# EAGLE design br1 (EAGLE 5.07)
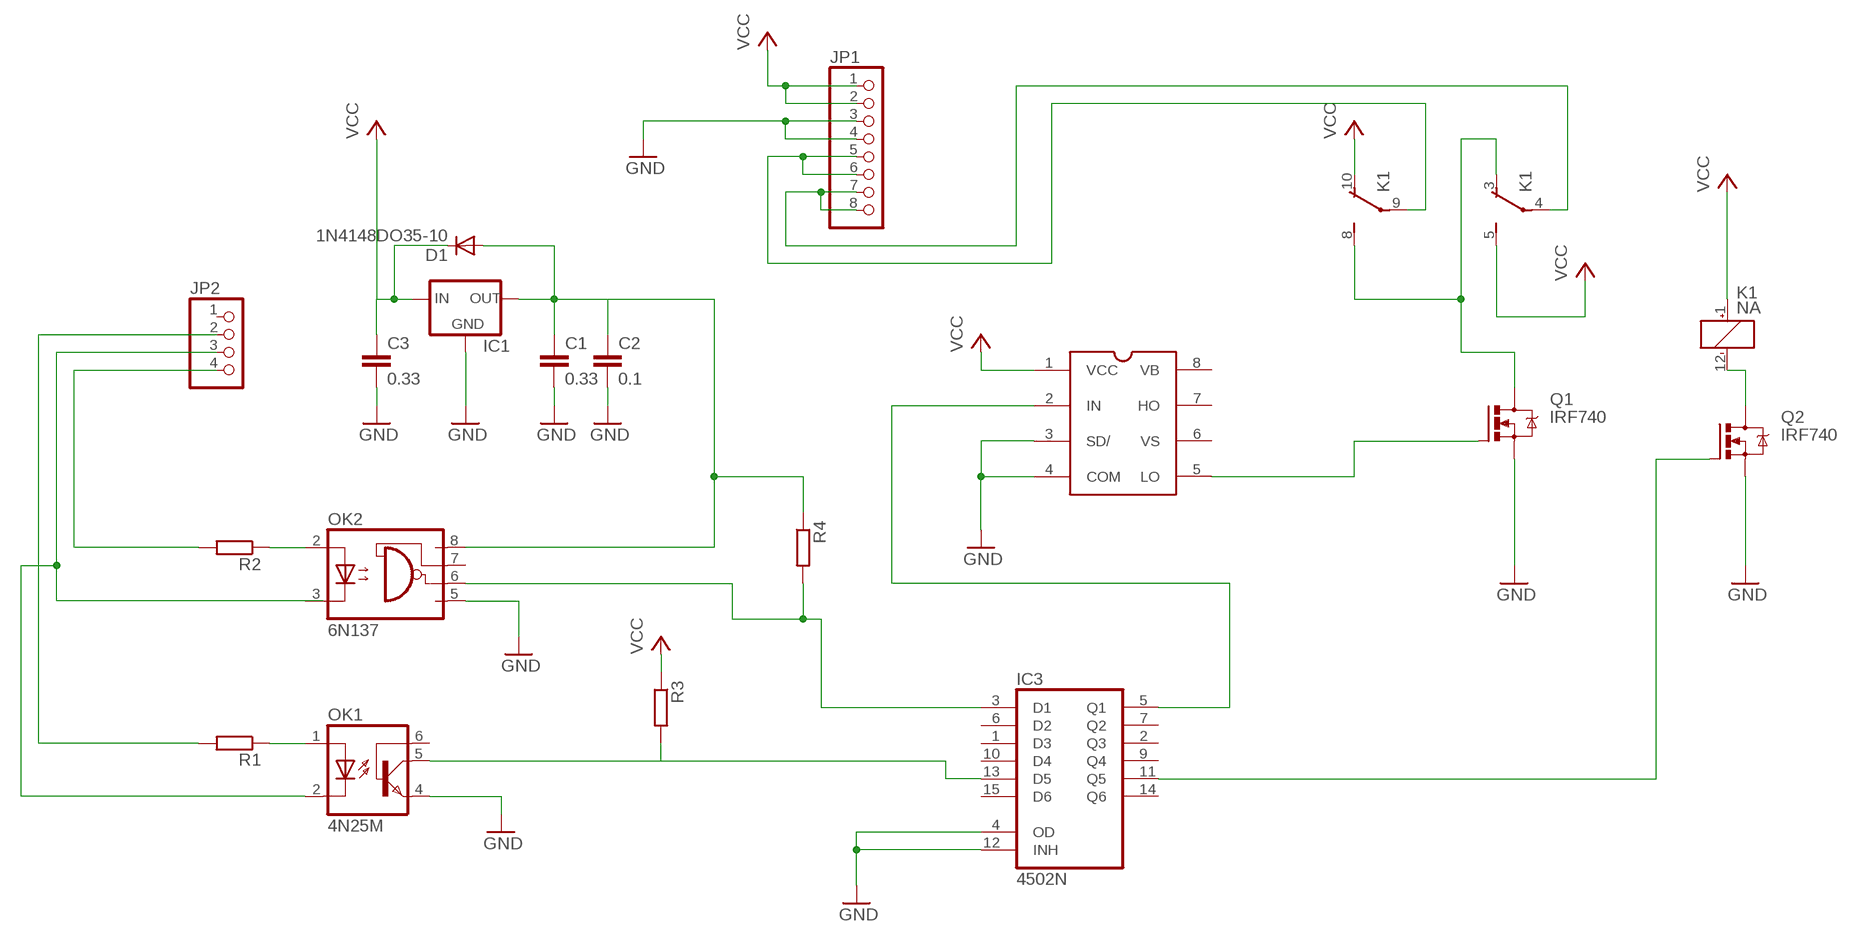
[diagram p0: schematic, sheet 1]

## Parts
C1  0.33  C-EU025-050X050  [C025-050X050]
C2  0.1  C-EU025-050X050  [C025-050X050]
C3  0.33  C-EU025-050X050  [C025-050X050]
D1  1N4148DO35-10  [DO35-10]
IC1  78XXS  [78XXS]
IC3  4502N  [DIL16]
JP1  PINHD-1X8  [1X08]
JP2  PINHD-1X4  [1X04]
K1  NA  [NA]
OK1  4N25M  [DIL06]
OK2  6N137  [DIL08]
Q1  IRF740  [TO220BV]
Q2  IRF740  [TO220BV]
R1  R-EU_0207/10  [0207/10]
R2  R-EU_0207/10  [0207/10]
R3  R-EU_0207/10  [0207/10]
R4  R-EU_0207/10  [0207/10]
U$1  IR2104  [IR2104]

## Nets
N$1: C1.1 C2.1 D1.A IC1.OUT OK2.8(VCC) R4.1
N$2: Q1.G U$1.5(LO)
N$3: K1.12(1:-) Q2.D
N$4: JP1.5 JP1.6 K1.9(3:P)
N$6: OK2.2(A) R2.1
N$7: K1.3(2:O) K1.8(3:S) Q1.D
N$8: OK1.1(A) R1.1
N$9: JP2.3 OK1.2(C)
N$10: JP2.2 R1.2
N$11: C1.2 C2.2 C3.2 IC1.GND IC3.4(OD) IC3.12(INH) JP1.3 JP1.4 OK1.4(EMI) OK2.5(GND) Q1.S Q2.S U$1.3(SD/) U$1.4(COM) ; supply symbol labelled GND
N$12: JP2.4 R2.2
N$13: IC3.13(D5) OK1.5(COL) R3.2
N$15: IC3.3(D1) OK2.6(VO) R4.2
N$17: IC3.5(Q1) U$1.2(IN)
N$18: JP1.7 JP1.8 K1.4(2:P)
N$19: IC3.11(Q5) Q2.G
VCC: C3.1 D1.C IC1.IN JP1.1 JP1.2 K1.1(1:+) K1.5(2:S) K1.10(3:O) R3.1 U$1.1(VCC)
Unconnected: IC3.1(D3) IC3.2(Q3) IC3.6(D2) IC3.7(Q2) IC3.9(Q4) IC3.10(D4) IC3.14(Q6) IC3.15(D6) JP2.1 OK1.6(BAS) OK2.3(C) OK2.7(VE) U$1.7(HO)

## Power pins joined to a net without a drawn wire
VB: U$1.8(VB)
VDD: IC3.16(VDD)
VS: U$1.6(VS)
VSS: IC3.8(VSS)

## Library data of the parts
C1-C3 = rcl:C-EU: CAPACITOR, European symbol
D1 = diode:1N4148: DIODE high speed (Philips)
IC1 = v-reg:78XXS: VOLTAGE REGULATOR
IC3 = 45xx:4502: Stored hex INVERTER/BUFFER
JP1 = pinhead:PINHD-1X8: PIN HEADER
JP2 = pinhead:PINHD-1X4: PIN HEADER
K1 = dbg-misc:NA: RELAY
OK1 = optocoupler:4N*?M: General Purpose 6-Pin Phototransistor Optocouplers Source: http://www.fairchildsemi.com/ds/4N/4N35-M.pdf
OK2 = optocoupler:6N137: MOTOROLA OPTO COUPLER
Q1 Q2 = transistor-power:IRF740: N-CHANNEL MOS FET
R1-R4 = rcl:R-EU_: RESISTOR, European symbol
U$1 = ir-2104:IR2104: Half Bridge mosfet - IGBT driver

## Board
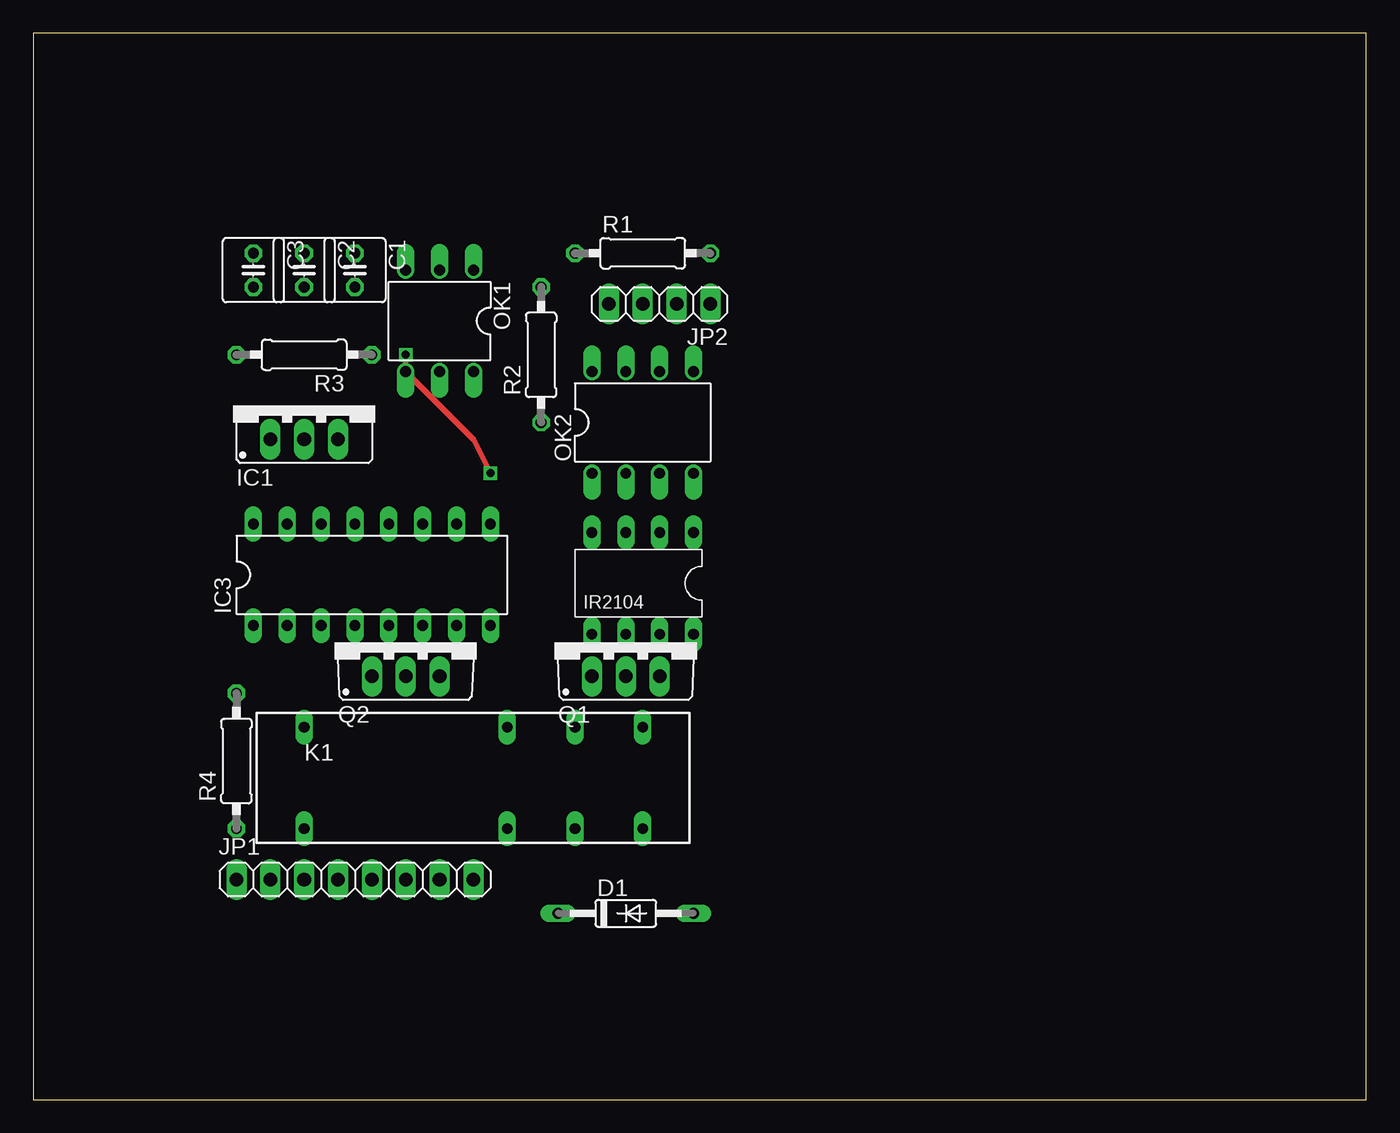
[diagram p1: board, top side]
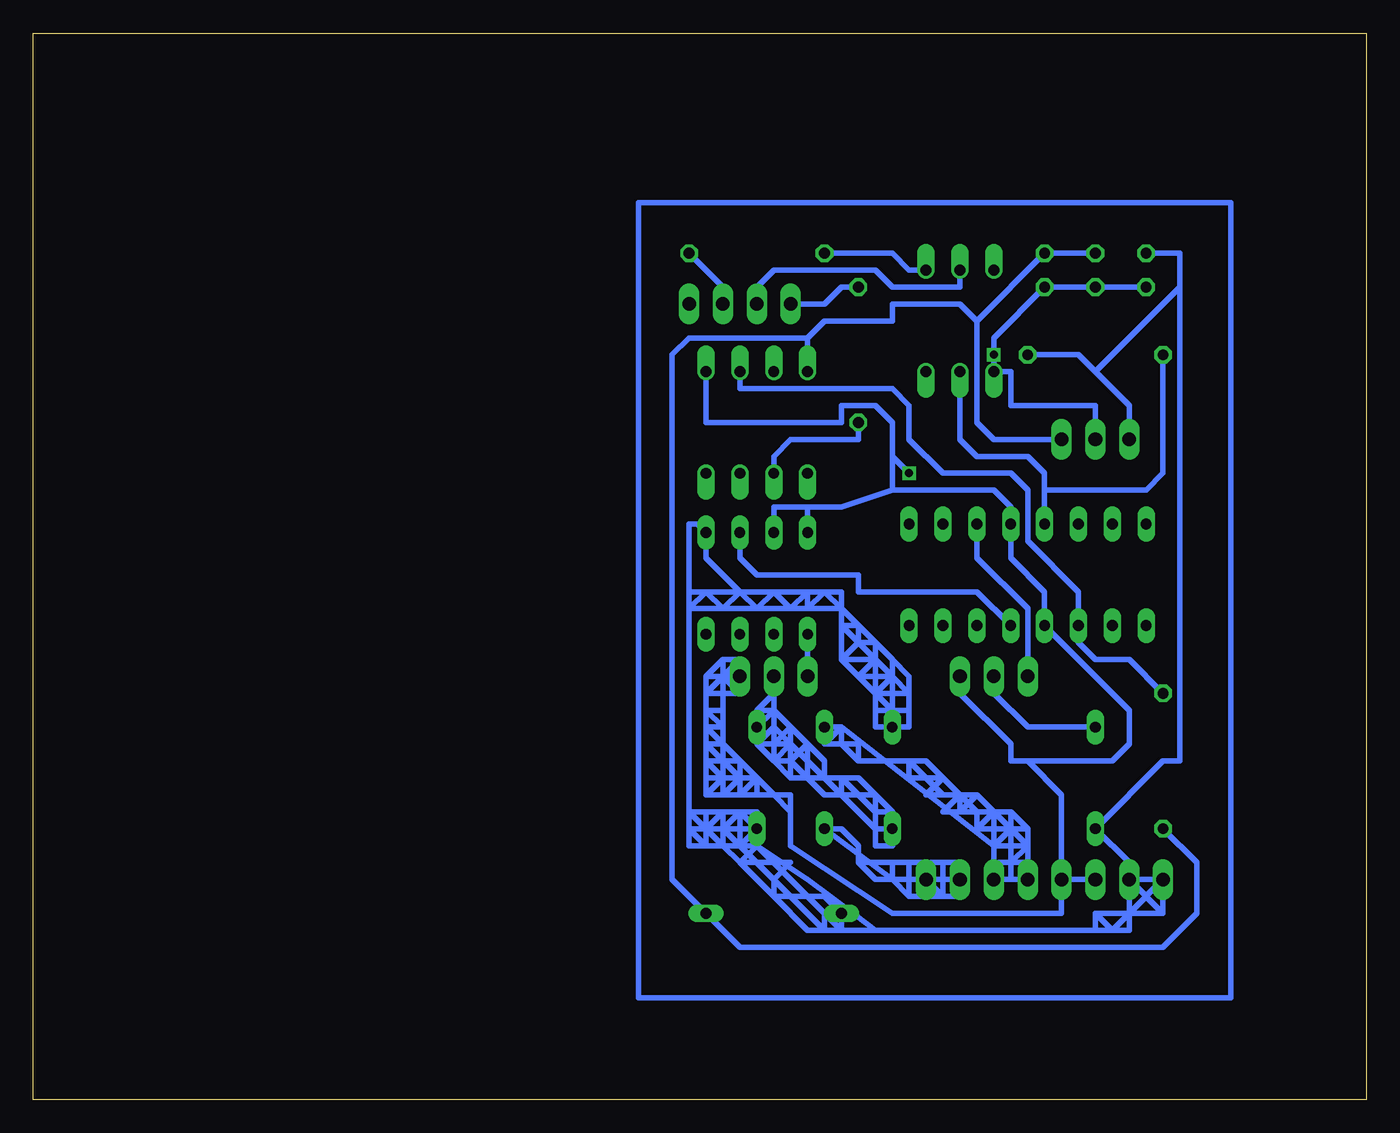
[diagram p2: board, bottom side, seen from below]

Size 100 x 80 mm. Coordinates in mm from the lower left corner, seen from the top.
Outline: 0,0 100,0 100,80 0,80 0,0
Copper layers (1*16): Top 0.0356mm / dielectric 1.5011mm / Bottom 0.0356mm
Design rules "default": minimum track width 7mil, minimum drill 14mil, track to track 7mil, track to pad 7mil, pad to pad 7mil, via to via 7mil, smd to smd 0mil, copper to edge 20mil, drill to drill 8mil, minimum pad ring 10mil, minimum via ring 8mil, stop-mask expansion 4mil, vias tented up to drill 0mil, thermal gap 10mil

### Footprints (pad centres in the part's own frame; a part is rotated, then mirrored left to right if it is on the bottom)
C025-050X050 = drill 0.813 octagon: 1 -1.27,0; 2 1.27,0
DO35-10 = drill 0.813 long: A 5.08,0; C -5.08,0
78XXS = drill 1.016 long: GND 0,-2.54; IN -2.54,-2.54; OUT 2.54,-2.54
DIL16 = drill 0.813 long: 1 -8.89,-3.81; 2 -6.35,-3.81; 3 -3.81,-3.81; 4 -1.27,-3.81; 5 1.27,-3.81; 6 3.81,-3.81; 7 6.35,-3.81; 8 8.89,-3.81; 9 8.89,3.81; 10 6.35,3.81; 11 3.81,3.81; 12 1.27,3.81; 13 -1.27,3.81; 14 -3.81,3.81; 15 -6.35,3.81; 16 -8.89,3.81
1X08 = drill 1.016 long: 1 -8.89,0; 2 -6.35,0; 3 -3.81,0; 4 -1.27,0; 5 1.27,0; 6 3.81,0; 7 6.35,0; 8 8.89,0
1X04 = drill 1.016 long: 1 -3.81,0; 2 -1.27,0; 3 1.27,0; 4 3.81,0
NA = drill 0.8 long: 1 -6.35,-5.08; 3 8.89,-5.08; 4 13.97,-5.08; 5 19.05,-5.08; 8 19.05,2.54; 9 13.97,2.54; 10 8.89,2.54; 12 -6.35,2.54
DIL06 = drill 0.813 offset: 1 -2.54,-3.81; 2 0,-3.81; 3 2.54,-3.81; 4 2.54,3.81; 5 0,3.81; 6 -2.54,3.81
DIL08 = drill 0.813 offset: 1 -3.81,-3.81; 2 -1.27,-3.81; 3 1.27,-3.81; 4 3.81,-3.81; 5 3.81,3.81; 6 1.27,3.81; 7 -1.27,3.81; 8 -3.81,3.81
TO220BV = drill 1.016 long: D 0,-2.54; G -2.54,-2.54; S 2.54,-2.54
0207/10 = drill 0.813 octagon: 1 -5.08,0; 2 5.08,0
IR2104 = drill 0.8 long: 1 -1.905,8.89; 2 -1.905,6.35; 3 -1.905,3.81; 4 -1.905,1.27; 5 5.715,1.27; 6 5.715,3.81; 7 5.715,6.35; 8 5.715,8.89

### Placement (x,y rotation side)
C1  24.13,62.23 270 top
C2  20.32,62.23 270 top
C3  16.51,62.23 270 top
D1  44.45,13.97 0 top
IC1  20.32,52.07 0 top
IC3  25.4,39.37 0 top
JP1  24.13,16.51 0 top
JP2  46.99,59.69 180 top
K1  26.67,25.4 0 top
OK1  30.48,58.42 180 top
OK2  45.72,50.8 0 top
Q1  44.45,34.29 0 top
Q2  27.94,34.29 0 top
R1  45.72,63.5 0 top
R2  38.1,55.88 90 top
R3  20.32,55.88 180 top
R4  15.24,25.4 90 top
U$1  40.64,40.64 270 top

### Tracks (layer width: path | path; a pad name or v marks a point on that pad's centre or on a via)
N$1
  Bottom 0.406: 41.91,57.15 50.8,57.15 52.07,55.88 52.07,16.51 D1.A 46.99,11.43 15.24,11.43 12.7,13.97 12.7,17.78 R4.1 | 41.91,57.15 OK2.8 | 41.91,57.15 40.64,58.42 35.56,58.42 35.56,59.69 30.48,59.69 29.21,58.42 | IC1.OUT 27.94,49.53 29.21,50.8 29.21,58.42 | 29.21,58.42 C1.1 C2.1
N$2
  Bottom 0.406: Q1.G U$1.5
N$3
  Bottom 0.406: Q2.D 27.94,30.48 25.4,27.94 K1.12
N$4
  Bottom 0.406: 39.37,27.94 K1.9 | 27.94,17.78 JP1.6 26.67,16.51 | 27.94,17.78 27.94,19.05 | 27.94,19.05 39.37,27.94 | 26.67,16.51 JP1.5 25.4,17.78 | 25.4,17.78 25.4,19.05 | 25.4,19.05 25.4,20.32 | 25.4,20.32 26.67,21.59 | 26.67,21.59 27.94,21.59 | 27.94,21.59 29.21,22.86 | 29.21,22.86 30.48,22.86 | 30.48,22.86 31.75,24.13 | 31.75,24.13 33.02,25.4 34.29,25.4 | 34.29,25.4 31.75,22.86 | 29.21,21.59 27.94,21.59 | 27.94,21.59 26.67,20.32 | 26.67,20.32 25.4,19.05 | 25.4,17.78 26.67,17.78 | 27.94,17.78 26.67,17.78 | 26.67,17.78 25.4,19.05 | 25.4,19.05 26.67,19.05 | 26.67,19.05 27.94,19.05 | 27.94,19.05 26.67,20.32 | 26.67,20.32 27.94,20.32 | 27.94,20.32 29.21,20.32 | 29.21,21.59 30.48,21.59 | 30.48,21.59 30.48,22.86 | 30.48,22.86 31.75,22.86 | 31.75,22.86 33.02,22.86 31.75,24.13 | 31.75,24.13 34.29,24.13 34.29,25.4 | 34.29,25.4 38.1,25.4 | 38.1,25.4 39.37,26.67 | 39.37,26.67 40.64,26.67 39.37,27.94 | 39.37,27.94 39.37,26.67 | 39.37,26.67 38.1,26.67 38.1,25.4 | 26.67,19.05 26.67,17.78 | 26.67,19.05 26.67,20.32 | 26.67,21.59 26.67,20.32 | 26.67,20.32 25.4,20.32 | 27.94,20.32 27.94,19.05 | 27.94,20.32 27.94,21.59 | 27.94,21.59 29.21,20.32 | 29.21,20.32 29.21,21.59 | 29.21,21.59 30.48,22.86 | 30.48,22.86 31.75,21.59 30.48,21.59 | 30.48,21.59 29.21,22.86 | 26.67,17.78 26.67,16.51
N$6
  Bottom 0.406: OK2.2 44.45,48.26 43.18,49.53 38.1,49.53 R2.1
N$7
  Bottom 0.406: 44.45,29.21 44.45,30.48 | 44.45,30.48 Q1.D | 45.72,26.67 K1.8 | 43.18,24.13 44.45,25.4 | 44.45,25.4 45.72,26.67 | 39.37,24.13 38.1,24.13 36.83,22.86 | 39.37,24.13 40.64,24.13 | 41.91,24.13 43.18,24.13 | 35.56,21.59 36.83,22.86 | K1.3 35.56,19.05 36.83,19.05 36.83,20.32 | 36.83,20.32 36.83,21.59 | 36.83,21.59 38.1,22.86 | 38.1,22.86 39.37,22.86 | 39.37,22.86 40.64,22.86 41.91,24.13 | 41.91,24.13 40.64,24.13 | 40.64,24.13 40.64,25.4 41.91,26.67 | 41.91,26.67 43.18,27.94 | 43.18,27.94 44.45,29.21 | 44.45,29.21 44.45,27.94 | 44.45,25.4 44.45,26.67 | 44.45,26.67 43.18,27.94 | 43.18,27.94 43.18,26.67 | 43.18,26.67 43.18,25.4 | 43.18,24.13 43.18,25.4 | 43.18,25.4 41.91,26.67 | 41.91,26.67 41.91,24.13 | 41.91,24.13 43.18,25.4 | 44.45,26.67 44.45,27.94 | 44.45,27.94 43.18,26.67 | 43.18,26.67 39.37,22.86 | 39.37,22.86 39.37,24.13 | 39.37,24.13 38.1,22.86 | 38.1,22.86 36.83,22.86 | 36.83,22.86 36.83,21.59 | 36.83,21.59 35.56,21.59 | 35.56,21.59 K1.3 | K1.3 36.83,20.32 | 36.83,20.32 39.37,22.86 | 43.18,25.4 44.45,25.4 | 44.45,25.4 43.18,26.67 | 43.18,26.67 44.45,26.67 | 45.72,26.67 44.45,27.94 | 45.72,26.67 44.45,26.67 | 44.45,30.48 45.72,29.21 | 45.72,29.21 K1.8 | K1.8 44.45,29.21 | 44.45,29.21 45.72,29.21
N$8
  Bottom 0.406: R1.1 35.56,63.5 34.29,62.23 OK1.1
N$9
  Bottom 0.406: JP2.3 45.72,60.96 44.45,62.23 36.83,62.23 35.56,60.96 30.48,60.96 OK1.2
N$10
  Bottom 0.406: JP2.2 48.26,60.96 R1.2
N$11  (via drill 0.6)
  Top 0.406: v34.29,46.99 33.02,49.53 OK1.4 v27.94,55.88
  Bottom 0.406: 46.99,33.02 48.26,33.02 | IC1.GND 20.32,52.07 26.67,52.07 26.67,54.61 OK1.4 v27.94,55.88 27.94,57.15 C1.2 C2.2 C3.2 | 48.26,29.21 48.26,30.48 | 48.26,31.75 Q1.S | 44.45,22.86 45.72,22.86 | 46.99,22.86 48.26,22.86 | 43.18,21.59 43.18,19.05 35.56,13.97 22.86,13.97 JP1.4 | 35.56,45.72 39.37,44.45 41.91,44.45 | 25.4,25.4 26.67,25.4 26.67,26.67 30.48,30.48 Q2.S | JP1.3 JP1.4 | JP1.4 22.86,22.86 25.4,25.4 | 25.4,25.4 19.05,25.4 17.78,26.67 17.78,29.21 IC3.4 24.13,38.1 26.67,40.64 IC3.12 26.67,44.45 27.94,45.72 35.56,45.72 | OK2.5 49.53,50.8 39.37,50.8 39.37,52.07 36.83,52.07 35.56,50.8 35.56,48.26 | 35.56,45.72 35.56,48.26 | 35.56,48.26 v34.29,46.99 | 41.91,44.45 U$1.4 | 41.91,44.45 44.45,44.45 U$1.3 | 48.26,31.75 48.26,30.48 | 48.26,30.48 46.99,30.48 | 48.26,30.48 49.53,30.48 | 49.53,30.48 49.53,31.75 | 48.26,31.75 49.53,30.48 | 49.53,30.48 49.53,29.21 | 49.53,29.21 49.53,27.94 | 49.53,27.94 49.53,26.67 | 49.53,26.67 49.53,25.4 | 49.53,25.4 49.53,24.13 | 49.53,24.13 49.53,22.86 | 48.26,22.86 48.26,24.13 | 48.26,24.13 48.26,25.4 | 48.26,26.67 48.26,27.94 | 48.26,27.94 49.53,29.21 | 49.53,29.21 48.26,29.21 | 48.26,29.21 48.26,27.94 | 48.26,27.94 49.53,27.94 | 49.53,27.94 48.26,26.67 | 48.26,26.67 49.53,26.67 | 49.53,26.67 48.26,25.4 | 48.26,25.4 49.53,25.4 | 49.53,25.4 48.26,24.13 | 49.53,24.13 48.26,24.13 | 48.26,24.13 49.53,22.86 | 49.53,22.86 48.26,22.86 | 48.26,22.86 46.99,24.13 | 46.99,24.13 48.26,24.13 | 46.99,24.13 45.72,24.13 | 45.72,24.13 45.72,22.86 | 45.72,22.86 46.99,22.86 | 46.99,22.86 45.72,24.13 | 45.72,24.13 44.45,22.86 | 44.45,22.86 43.18,21.59 | 43.18,21.59 43.18,22.86 44.45,22.86 | 45.72,24.13 46.99,25.4 | 46.99,25.4 48.26,26.67
  Bottom 0.406: 48.26,26.67 48.26,25.4 | 48.26,25.4 46.99,25.4 | 46.99,25.4 46.99,24.13 | 48.26,33.02 49.53,31.75 | 49.53,31.75 48.26,31.75 | 48.26,31.75 46.99,33.02 | 46.99,33.02 46.99,30.48 | 46.99,30.48 48.26,31.75 | 48.26,31.75 48.26,33.02 | 48.26,30.48 48.26,27.94 | 48.26,25.4 46.99,24.13 | 46.99,24.13 46.99,22.86
N$12
  Bottom 0.406: R2.2 39.37,60.96 40.64,59.69 JP2.4
N$13
  Bottom 0.406: 24.13,45.72 IC3.13 | 24.13,45.72 24.13,46.99 25.4,48.26 29.21,48.26 30.48,49.53 OK1.5 | 24.13,45.72 16.51,45.72 15.24,46.99 R3.2
N$14  (via drill 0.6)
  other vias: 27.94,55.88
N$15
  Bottom 0.406: OK2.6 46.99,53.34 35.56,53.34 34.29,52.07 34.29,49.53 31.75,46.99 26.67,46.99 25.4,45.72 25.4,41.91 21.59,38.1 IC3.3 21.59,34.29 20.32,33.02 17.78,33.02 R4.2
N$16
  Bottom 0.406: 10.16,67.31 54.61,67.31 54.61,7.62 10.16,7.62 10.16,67.31
N$17
  Bottom 0.406: U$1.2 46.99,40.64 45.72,39.37 38.1,39.37 38.1,38.1 29.21,38.1 IC3.5
N$18
  Bottom 0.406: 35.56,17.78 36.83,17.78 38.1,17.78 | 35.56,17.78 34.29,17.78 | 33.02,17.78 31.75,17.78 | 31.75,17.78 30.48,17.78 JP1.7 | 35.56,16.51 K1.4 39.37,20.32 38.1,19.05 38.1,17.78 | JP1.8 34.29,16.51 | 34.29,16.51 35.56,16.51 | 31.75,16.51 JP1.8 | JP1.7 30.48,15.24 31.75,15.24 | 31.75,15.24 33.02,15.24 | 33.02,15.24 34.29,15.24 | 35.56,16.51 36.83,16.51 38.1,17.78 | JP1.7 31.75,16.51 | 31.75,16.51 31.75,17.78 | 31.75,16.51 31.75,15.24 | 31.75,15.24 JP1.8 | JP1.8 33.02,15.24 | JP1.8 33.02,17.78 | 33.02,17.78 34.29,17.78 | 34.29,17.78 34.29,16.51 | 34.29,16.51 34.29,15.24 | 34.29,15.24 35.56,16.51 | 35.56,16.51 35.56,17.78
N$19
  Bottom 0.406: Q2.G 25.4,36.83 29.21,40.64 IC3.11
VCC
  Bottom 0.406: 39.37,36.83 39.37,38.1 40.64,38.1 | 39.37,35.56 39.37,33.02 | 39.37,33.02 38.1,31.75 | 38.1,31.75 36.83,30.48 | 36.83,30.48 35.56,29.21 | 35.56,29.21 K1.10 | 36.83,12.7 38.25,13.77 | 38.25,13.77 41.91,16.51 45.72,19.05 | 19.05,12.7 20.32,12.7 | 20.32,12.7 36.83,12.7 | JP1.2 17.78,13.97 | 17.78,13.97 17.78,12.7 19.05,12.7 | 45.72,19.05 K1.5 | 46.99,38.1 44.45,38.1 | 44.45,38.1 41.91,38.1 | 41.91,38.1 40.64,38.1 | 46.99,38.1 49.53,40.64 U$1.1 50.16,43.18 50.8,43.18 50.8,38.1 | JP1.2 17.78,17.78 K1.1 15.24,25.4 13.97,25.4 13.97,60.96 | K1.5 48.26,20.32 | 49.53,20.32 50.8,20.32 | 50.8,20.32 50.8,21.59 | IC1.IN 17.78,52.07 20.32,54.61 | C3.1 13.97,63.5 13.97,60.96 | 13.97,60.96 20.32,54.61 | D1.C 38.46,13.97 38.25,13.77 | R3.1 21.59,55.88 20.32,54.61 | 46.99,38.1 49.53,38.1 | 49.53,38.1 50.8,38.1 | 50.8,38.1 50.8,36.83 | 50.8,36.83 50.8,21.59 | 49.53,20.32 50.8,21.59 | 50.8,21.59 49.53,21.59 | 48.26,21.59 46.99,21.59 | 46.99,21.59 45.72,21.59 K1.5 | 48.26,19.05 49.53,19.05 | 49.53,19.05 50.8,19.05 50.8,20.32 | 50.8,20.32 49.53,19.05 | 49.53,19.05 49.53,20.32 | 49.53,20.32 48.26,21.59 | 48.26,21.59 48.26,20.32 | 48.26,20.32 48.26,19.05 | 48.26,19.05 49.53,20.32 | 49.53,20.32 48.26,20.32 | 48.26,20.32 46.99,21.59 | 46.99,21.59 46.99,19.05 | 48.26,20.32 46.99,19.05 | 46.99,19.05 K1.5 | K1.5 46.99,21.59 | 48.26,21.59 49.53,21.59 | 49.53,21.59 49.53,20.32 | 35.56,33.02 35.56,31.75 | 35.56,31.75 35.56,29.21 | 35.56,29.21 36.83,29.21 | 36.83,29.21 36.83,27.94 K1.10 | K1.10 34.29,27.94 34.29,29.21 | 35.56,29.21 34.29,29.21 | 34.29,29.21 34.29,30.48 | 34.29,30.48 34.29,31.75 35.56,33.02 | 35.56,33.02 36.83,34.29 | 36.83,34.29 38.1,35.56 | 38.1,35.56 39.37,36.83 | 39.37,36.83 41.91,36.83
  Bottom 0.406: 41.91,36.83 43.18,36.83 | 43.18,36.83 45.72,36.83 | 45.72,36.83 48.26,36.83 | 48.26,36.83 50.8,36.83 | 50.8,36.83 49.53,38.1 | 49.53,38.1 48.26,36.83 | 48.26,36.83 46.99,38.1 | 46.99,38.1 45.72,36.83 | 45.72,36.83 44.45,38.1 | 44.45,38.1 43.18,36.83 | 43.18,36.83 41.91,38.1 | 41.91,38.1 41.91,36.83 | 41.91,36.83 40.64,38.1 | 40.64,38.1 39.37,36.83 | 39.37,36.83 39.37,35.56 | 39.37,35.56 38.1,34.29 | 38.1,34.29 36.83,33.02 | 36.83,33.02 35.56,31.75 | 35.56,31.75 34.29,30.48 | 34.29,30.48 36.83,30.48 | 36.83,30.48 35.56,31.75 | 35.56,31.75 38.1,31.75 | 38.1,31.75 36.83,33.02 | 36.83,33.02 39.37,33.02 | 39.37,33.02 38.1,34.29 | 36.83,29.21 36.83,30.48 | 36.83,30.48 36.83,34.29 | 36.83,34.29 38.1,34.29 | 38.1,34.29 38.1,35.56 | 38.1,35.56 39.37,35.56 | 36.83,12.7 39.37,12.7 | 39.37,12.7 40.64,12.7 | 40.64,12.7 41.91,12.7 44.45,15.24 | 44.45,15.24 46.99,17.78 | 46.99,17.78 48.26,19.05 | 48.26,19.05 46.99,19.05 | 46.99,19.05 40.64,12.7 | 40.64,12.7 40.64,13.97 | 40.64,13.97 41.91,15.24 | 41.91,15.24 45.72,19.05 | 40.64,13.97 39.37,12.7 | 39.37,12.7 D1.C | D1.C 40.64,15.24 41.91,15.24 | 41.91,15.24 44.45,15.24 | 44.45,15.24 44.45,16.51 43.18,17.78 46.99,17.78 | 46.99,17.78 45.72,19.05 | 45.72,19.05 46.99,19.05 | JP1.1 15.24,13.97 | 15.24,13.97 17.78,13.97 | 17.78,13.97 20.32,13.97 | 20.32,13.97 20.32,12.7 | 20.32,13.97 19.05,12.7 | 19.05,12.7 17.78,13.97 | 17.78,13.97 JP1.1 | JP1.1 JP1.2 | JP1.2 15.24,13.97